# EAGLE design PowerSupply (EAGLE 9.4.1)
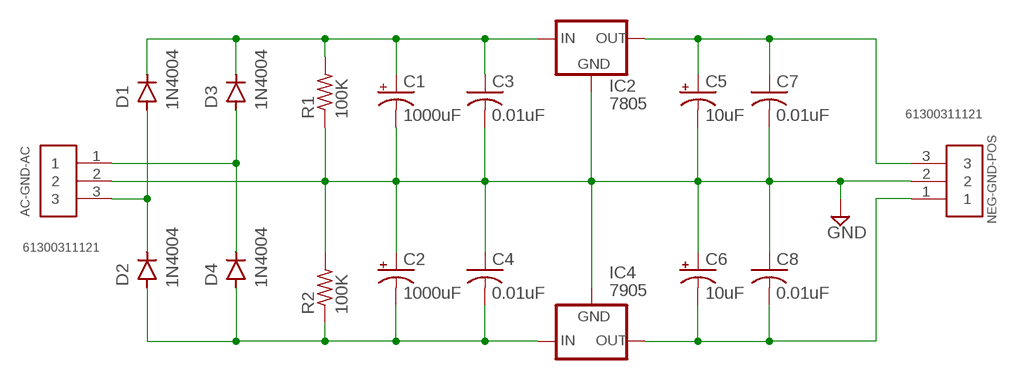
[diagram p0: schematic, sheet 1]

## Parts
AC-GND-AC  61300311121  [61300311121]
C1  1000uF  CPOL-USE3.5-8  [E3,5-8]
C2  1000uF  CPOL-USE3.5-8  [E3,5-8]
C3  0.01uF  C-US050-025X075  [C050-025X075]
C4  0.01uF  C-US050-025X075  [C050-025X075]
C5  10uF  CPOL-USE2.5-6  [E2,5-6]
C6  10uF  CPOL-USE2.5-6  [E2,5-6]
C7  0.01uF  C-US050-025X075  [C050-025X075]
C8  0.01uF  C-US050-025X075  [C050-025X075]
D1  1N4004  [DO-41]
D2  1N4004  [DO-41]
D3  1N4004  [DO-41]
D4  1N4004  [DO-41]
IC2  7805  78XXS  [78XXS]
IC4  7905  79XXS  [79XXS]
NEG-GND-POS  61300311121  [61300311121]
R1  100K  R-US_0411/12  [0411/12]
R2  100K  R-US_0411/12  [0411/12]

## Nets
AC1: AC-GND-AC.1 D3.A D4.C
AC2: AC-GND-AC.3 D1.A D2.C
GND: AC-GND-AC.2 C1.- C2.+ C3.2 C4.1 C5.- C6.+ C7.2 C8.1 IC2.GND IC4.GND NEG-GND-POS.2 R1.1 R2.2
N$1: C6.- C8.2 IC4.OUT NEG-GND-POS.1
N$2: C5.+ C7.1 IC2.OUT NEG-GND-POS.3
N$3: C1.+ C3.1 D1.C D3.C IC2.IN R1.2
N$4: C2.- C4.2 D2.A D4.A IC4.IN R2.1

## Library data of the parts
AC-GND-AC NEG-GND-POS = Headers:61300311121: CONN HEADER VERT 3POS 2.54MM Manufacturer's datasheet <https://katalog.we-online.de/em/datasheet/6130xx11121.pdf>; CREATED_BY: PCBLayout.com; DIGI_KEY_PART_NUMBER: 732-5316-ND; MANUFACTURER: Wurth Electronics Inc.; MPN: 61300311121
C1 C2 C5 C6 = adafruit:CPOL-US: POLARIZED CAPACITOR, American symbol
C3 C4 C7 C8 = adafruit:C-US: CAPACITOR, American symbol
D1-D4 = Diodes:1N4004: DIODE GEN PURP 400V 1A DO41 Manufacturer's datasheet <https://www.mccsemi.com/pdf/Products/1N4001-1N4007(DO-41).pdf>; CREATED_BY: PCBLayout.com; DIGIKEY_PART_NUMBER: 1N4004MSCT-ND; MANUFACTURER: Micro Commercial Co; MPN: 1N4004; PACKAGE: DO-41
IC2 = v-reg:78XXS: VOLTAGE REGULATOR
IC4 = v-reg:79XXS: VOLTAGE REGULATOR
R1 R2 = adafruit:R-US_: RESISTOR, American symbol

## Board
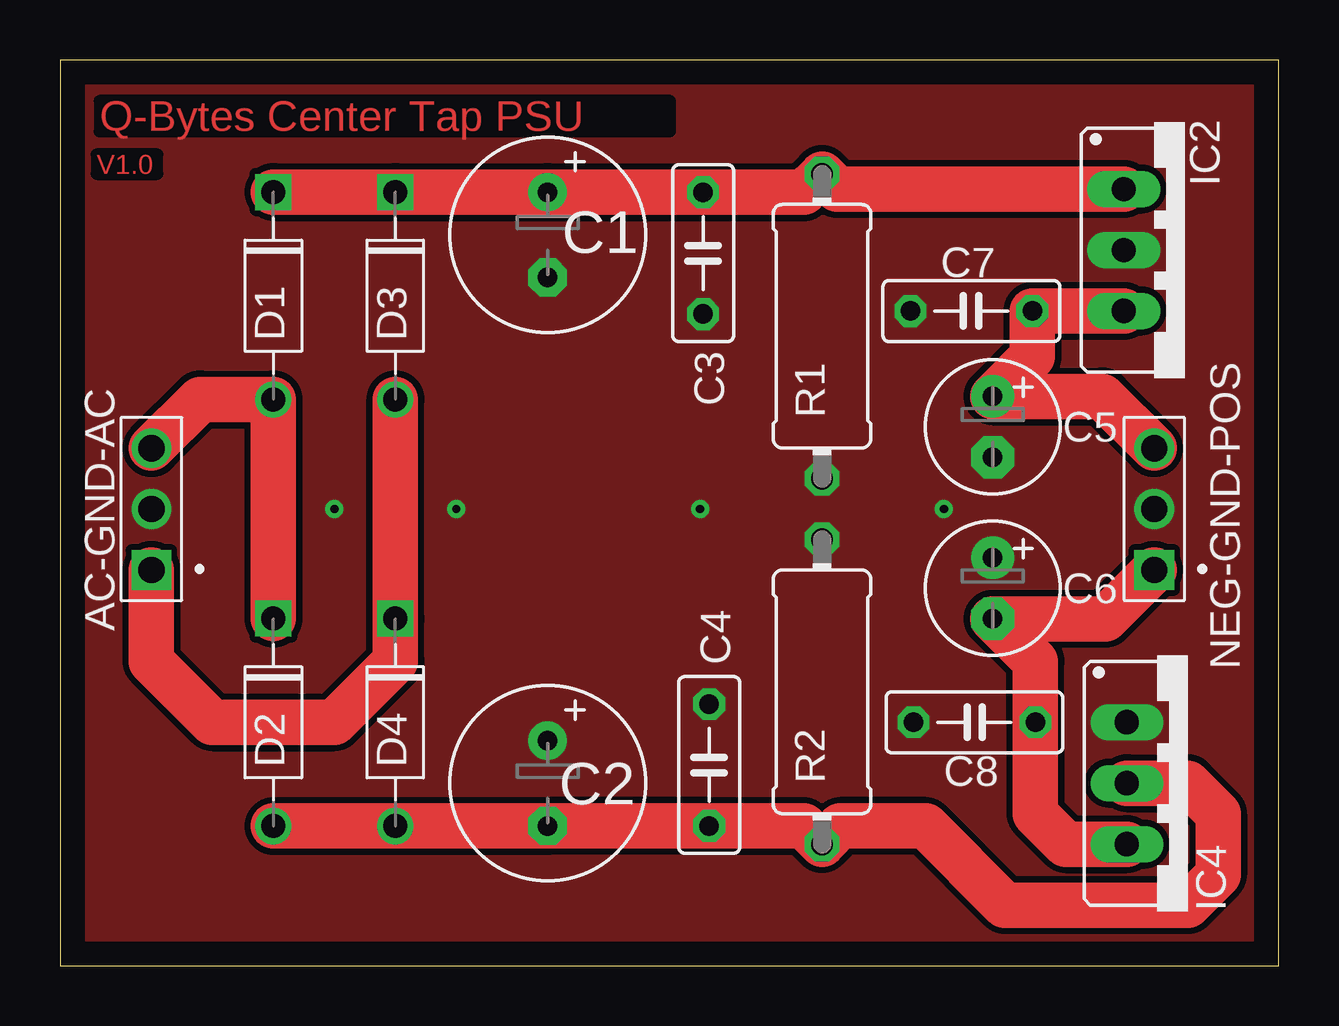
[diagram p1: board, top side]
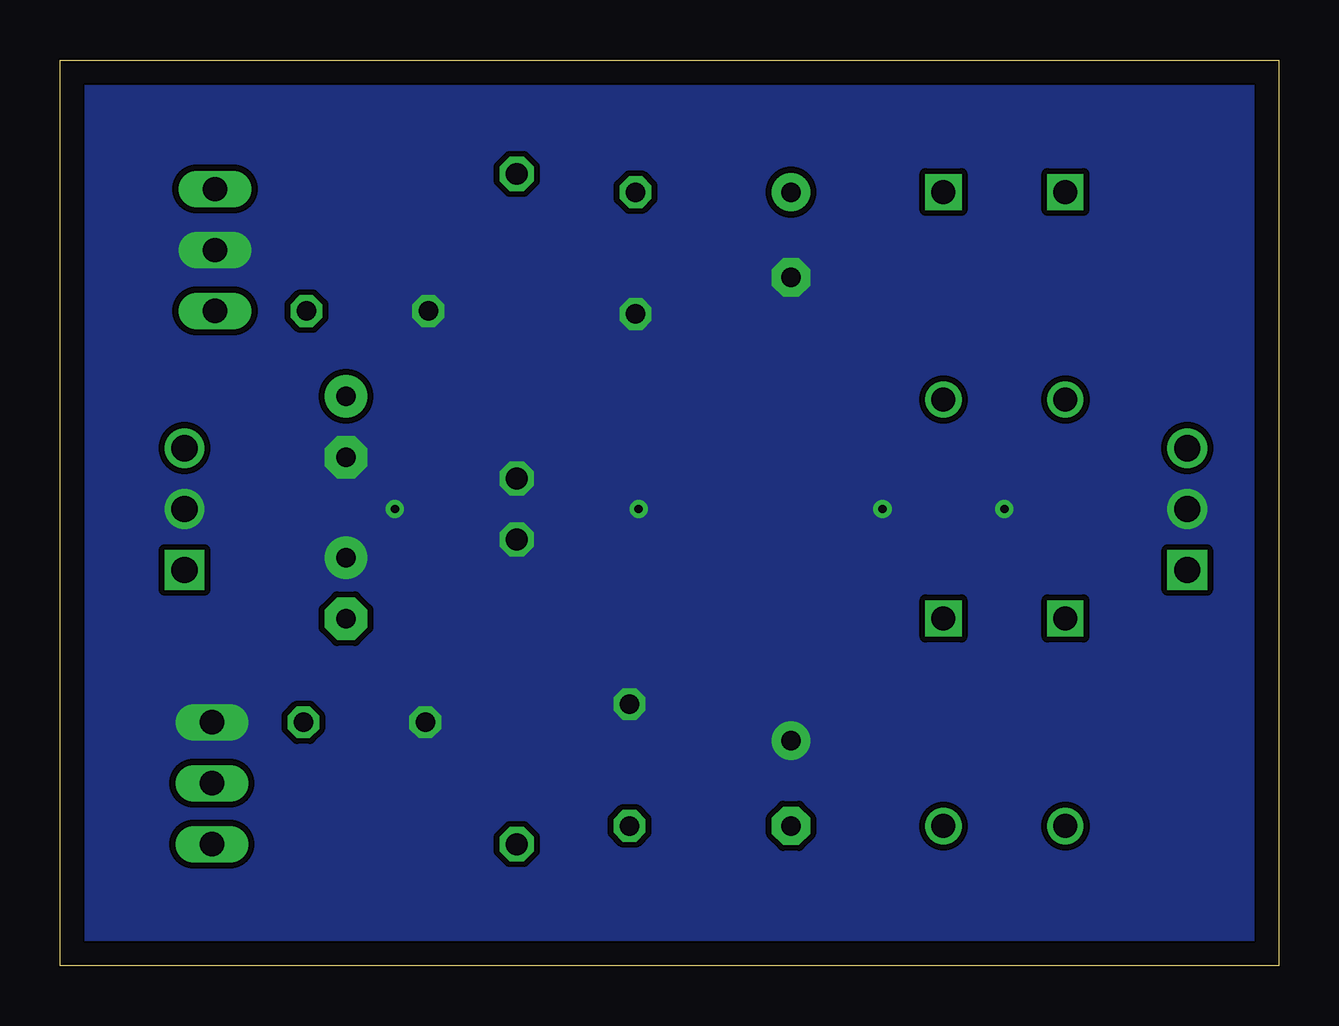
[diagram p2: board, bottom side, seen from below]

Size 50.78 x 37.77 mm. Coordinates in mm from the lower left corner, seen from the top.
Outline: 0,0 50.78,0 50.78,37.77 0,37.77 0,0
Copper layers (1*16): Top 0.035mm / dielectric 1.5mm / Bottom 0.035mm
Design rules "default *": minimum track width 6mil, minimum drill 0.35mm, track to track 10mil, track to pad 10mil, pad to pad 10mil, via to via 10mil, smd to smd 10mil, copper to edge 40mil, drill to drill 6mil, minimum pad ring 10mil, minimum via ring 8mil, stop-mask expansion 4mil, vias tented up to drill 0mil, thermal gap 0mil

### Footprints (pad centres in the part's own frame; a part is rotated, then mirrored left to right if it is on the bottom)
61300311121 = drill 1.1 square: 1 -2.54,0 | drill 1.1: 2 0,0; 3 2.54,0
E3,5-8 = drill 0.813 pad 1.6: + -1.778,0 | drill 0.813 pad 1.6 octagon: - 1.778,0
C050-025X075 = drill 0.813 octagon: 1 -2.54,0; 2 2.54,0
E2,5-6 = drill 0.813 pad 1.778: + -1.27,0 | drill 0.813 pad 1.778 octagon: - 1.27,0
DO-41 = drill 1: A 4.325,0 | drill 1 square: C -4.325,0
78XXS = drill 1.016 long: GND 0,-2.54; IN -2.54,-2.54; OUT 2.54,-2.54
79XXS = drill 1.016 long: GND -2.54,-2.54; IN 0,-2.54; OUT 2.54,-2.54
0411/12 = drill 0.914 octagon: 1 -6.35,0; 2 6.35,0

### Placement (x,y rotation side)
AC-GND-AC  3.81,19.05 90 top
C1  20.32,30.48 270 top
C2  20.32,7.62 270 top
C3  26.8,29.72 270 top
C4  27.05,8.38 270 top
C5  38.86,22.48 270 top
C6  38.86,15.75 270 top
C7  37.97,27.3 180 top
C8  38.1,10.16 0 top
D1  8.89,27.94 270 top
D2  8.89,10.16 270 top
D3  13.97,27.94 270 top
D4  13.97,10.16 270 top
IC2  46.86,29.84 270 top
IC4  46.99,7.62 270 top
NEG-GND-POS  45.59,19.05 90 top
R1  31.75,26.67 90 top
R2  31.75,11.43 90 top

### Tracks (layer width: path | path; a pad name or v marks a point on that pad's centre or on a via)
AC1
  Top 1.905: D3.A D4.C 13.97,12.7 11.43,10.16 6.35,10.16 3.81,12.7 AC-GND-AC.1
AC2
  Top 1.905: AC-GND-AC.3 5.83,23.61 D1.A D2.C
GND  (via drill 0.35)
  other vias: 11.43,19.05 16.51,19.05 36.83,19.05 26.67,19.05
  pour Bottom: 51.18,38.08 51.18,-0.38 -0.25,-0.38 -0.25,37.72
  pour Top: 51.18,38.08 51.18,-0.38 -0.25,-0.38 -0.25,37.72
N$1
  Top 1.905: IC4.OUT 41.91,5.08 40.64,6.35 C8.2 40.64,12.7 C6.- 43.56,14.48 NEG-GND-POS.1
N$2
  Top 1.905: IC2.OUT C7.1 40.51,25.4 C5.+ 43.43,23.75 NEG-GND-POS.3
N$3
  Top 1.905: D1.C D3.C C1.+ C3.1 30.99,32.26 R1.2 32.38,32.38 IC2.IN
N$4
  Top 1.905: D2.A D4.A 13.98,5.84 C2.- C4.2 30.99,5.84 R2.1 32.51,5.84 36.07,5.84 39.37,2.54 46.99,2.54 48.26,3.81 48.26,6.35 46.99,7.62 IC4.IN

### Text on the board
Top: Q-Bytes Center Tap PSU | V1.0